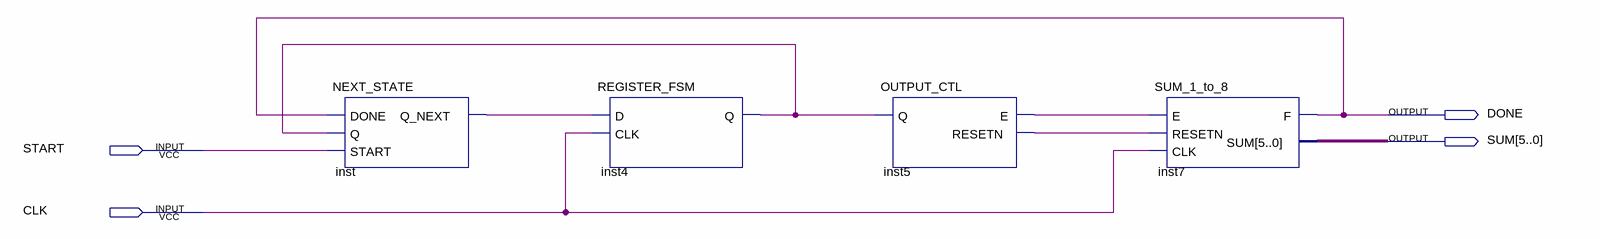
[diagram p0: schematic sheet]
// Quartus schematic TOP.bdf as structural Verilog: 4 symbols, 4 pins
module TOP (
  input  START,
  input  CLK,
  output DONE,
  output [5:0] SUM
);

  wire inst4_q, inst5_e, inst5_resetn, inst_q_next;

  NEXT_STATE inst (.DONE(DONE), .Q(inst4_q), .START(START), .Q_NEXT(inst_q_next));
  REGISTER_FSM inst4 (.D(inst_q_next), .CLK(CLK), .Q(inst4_q));
  OUTPUT_CTL inst5 (.Q(inst4_q), .E(inst5_e), .RESETN(inst5_resetn));
  SUM_1_to_8 inst7 (.E(inst5_e), .RESETN(inst5_resetn), .CLK(CLK), .SUM(SUM), .F(DONE));
endmodule
